# EAGLE schematic LandR_L1 (EAGLE 7.2.0)
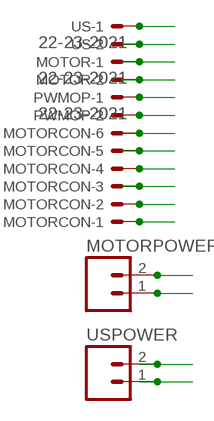
[diagram p0: schematic, sheet 1]

## Parts
MOTOR  22-23-2021  [22-23-2021]
MOTORCON  22-23-2061  [22-23-2061]
MOTORPOWER  M025MM  [SCREWTERMINAL-5MM-2]
PWMOP  22-23-2021  [22-23-2021]
US  22-23-2021  [22-23-2021]
USPOWER  M025MM  [SCREWTERMINAL-5MM-2]

## Nets
MOTORENC: MOTOR.1
N$1: US.1
N$2: US.2
N$4: MOTOR.2
N$5: PWMOP.1
N$6: PWMOP.2
N$7: MOTORCON.6
N$8: MOTORCON.5
N$9: MOTORCON.4
N$10: MOTORCON.3
N$11: MOTORCON.2
N$12: MOTORCON.1
N$13: MOTORPOWER.2
N$14: MOTORPOWER.1
N$15: USPOWER.2
N$16: USPOWER.1

## Library data of the parts
MOTOR PWMOP US = con-molex:22-23-2021: .100" (2.54mm) Center Header - 2 Pin; MF: MOLEX; MPN: 22-23-2021; OC_FARNELL: 1462926; OC_NEWARK: 25C3832
MOTORCON = con-molex:22-23-2061: .100" (2.54mm) Center Header - 6 Pin; MF: MOLEX; MPN: 22-23-2061; OC_FARNELL: 1462922; OC_NEWARK: 27C1933
MOTORPOWER USPOWER = SparkFun-Connectors:M02: Standard 2-pin 0.1" header. Use with - straight break away headers ( PRT-00116) - right angle break away headers (PRT-00553) - swiss pins (PRT-00743) - machine pins (PRT-00117) - female headers (PRT-00115) Molex polarized connector foot print use with: PRT-08233 with associated crimp pins and housings. 2.54_SCREWTERM for use with PRT-10571. 3.5mm Screw Terminal footprints for PRT-08084 5mm Screw Terminal footprints for use with PRT-08432; STOREFRONT_ID: PRT-08432